# Altium schematic sheet BMS.SchDoc
size A; SheetNumber: 3; SheetTotal: 6
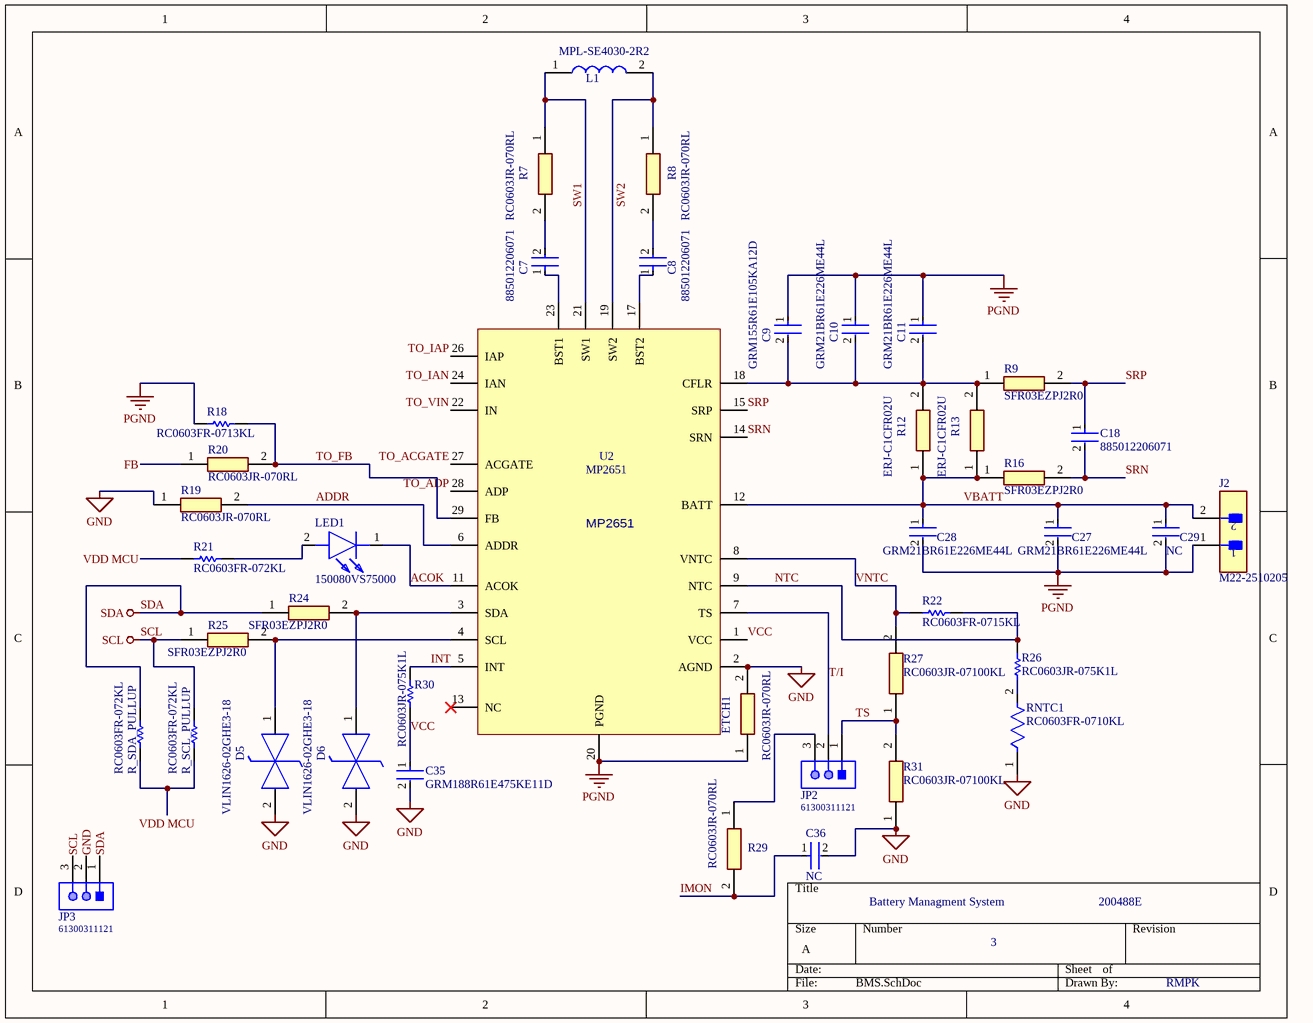
[diagram p0: BMS.SchDoc]

## Parts
C7  885012206071  [FP-885012206071-MFG]
C8  885012206071  [FP-885012206071-MFG]
C9  GRM155R61E105KA12D  [FP-GRM155-0_05-IPC_B]
C10  GRM21BR61E226ME44L  [FP-GRM21B-0_2-e0_2_0_7-IPC_B]
C11  GRM21BR61E226ME44L  [FP-GRM21B-0_2-e0_2_0_7-IPC_B]
C18  885012206071  [FP-885012206071-MFG]
C27  GRM21BR61E226ME44L  [FP-GRM21B-0_2-e0_2_0_7-IPC_B]
C28  GRM21BR61E226ME44L  [FP-GRM21B-0_2-e0_2_0_7-IPC_B]
C29  NC  [FP-GRM21B-0_2-e0_2_0_7-IPC_B]
C35  GRM188R61E475KE11D  [FP-GRM188-0_15-IPC_C]
C36  NC  [FP-GRM21B-0_2-e0_2_0_7-IPC_B]
D5  VLIN1626-02GHE3-18  [SOD2713X115N]
D6  VLIN1626-02GHE3-18  [SOD2713X115N]
ETCH1  RC0603JR-070RL  [RESC1608X55N]
J2  M22-2510205  [FP-M22-2510205-MFG]
JP2  61300311121  [61300311121]
JP3  61300311121  [61300311121]
L1  MPL-SE4030-2R2  [MPLSE40302R2]
LED1  150080VS75000  [LEDC2012X80N]
R7  RC0603JR-070RL  [RESC1608X55N]
R8  RC0603JR-070RL  [RESC1608X55N]
R9  SFR03EZPJ2R0  [RESC1608X55N]
R12  ERJ-C1CFR02U  [ERJC1]
R13  ERJ-C1CFR02U  [ERJC1]
R16  SFR03EZPJ2R0  [RESC1608X55N]
R18  RC0603FR-0713KL  [RESC1608X55X25LL10T15]
R19  RC0603JR-070RL  [RESC1608X55N]
R20  RC0603JR-070RL  [RESC1608X55N]
R21  RC0603FR-072KL  [RESC1608X55X25LL10T15]
R22  RC0603FR-0715KL  [RESC1608X55X25LL10T15]
R24  SFR03EZPJ2R0  [RESC1608X55N]
R25  SFR03EZPJ2R0  [RESC1608X55N]
R26  RC0603JR-075K1L  [RESC1608X55X25LL10T15]
R27  RC0603JR-07100KL  [RESC1608X55N]
R29  RC0603JR-070RL  [RESC1608X55N]
R30  RC0603JR-075K1L  [RESC1608X55X25LL10T15]
R31  RC0603JR-07100KL  [RESC1608X55N]
R_SCL_PULLUP  RC0603FR-072KL  [RESC1608X55X25LL10T15]
R_SDA_PULLUP  RC0603FR-072KL  [RESC1608X55X25LL10T15]
RNTC1  RC0603FR-0710KL  [FP-RC0603-0_55-IPC_C]
U2  MP2651  [MP2651]

## Nets
GND: C35.2 C36.2 D5.2(K2) D6.2(K2) ETCH1.2 JP3.2 R19.1 R31.1 RNTC1.1 U2.2(AGND)
PGND: C9.1 C10.1 C11.1 C27.2 C28.2 C29.2 ETCH1.1 J2.1 R18.1 U2.20(PGND)
SCL: JP3.3 R25.1 R_SCL_PULLUP.2
SDA: JP3.1 R24.1 R_SDA_PULLUP.2
ACOK: LED1.1(K) U2.11(ACOK)
ADDR: R19.2 U2.6(ADDR)
FB: R20.1
IMON: C36.1 R29.2
INT: R30.2 U2.5(INT)
NTC: R22.2 R26.2 U2.9(NTC)
SRN: C18.2 R16.2 U2.14(SRN)
SRP: C18.1 R9.2 U2.15(SRP)
SW1: L1.1 R7.1 U2.21(SW1)
SW2: L1.2 R8.1 U2.19(SW2)
T/I: JP2.2 U2.7(TS)
TO_ACGATE: U2.27(ACGATE)
TO_ADP: U2.28(ADP)
TO_FB: R18.2 R20.2 U2.29(FB)
TO_IAN: U2.24(IAN)
TO_IAP: U2.26(IAP)
TO_VIN: U2.22(IN)
TS: JP2.1 R27.1 R31.2
VBATT: C27.1 C28.1 C29.1 J2.2 R12.1 R13.1 R16.1 U2.12(BATT)
VCC: C35.1 R30.1 U2.1(VCC)
VDD MCU: R21.1 R_SCL_PULLUP.1 R_SDA_PULLUP.1
VNTC: R22.1 R27.2 U2.8(VNTC)
NetC7_1: C7.1 U2.23(BST1)
NetC7_2: C7.2 R7.2
NetC8_1: C8.1 U2.17(BST2)
NetC8_2: C8.2 R8.2
NetC9_2: C9.2 C10.2 C11.2 R9.1 R12.2 R13.2 U2.18(CFLR)
NetD5_1: D5.1(K1) R25.2 U2.4(SCL)
NetD6_1: D6.1(K1) R24.2 U2.3(SDA)
NetJP2_3: JP2.3 R29.1
NetLED1_2: LED1.2(A) R21.2
NetR26_1: R26.1 RNTC1.2

Not connected (* = marked no-connect by the designer): U2 13(NC)*

## Notes on the sheet
- Battery Managment System
- 200488E
- 3
- RMPK

## Library data of the parts
C7 C8 C18 = CMP-207839-000033-1: CAP CER 0.1UF 25V X7R 0603; Capacitance: 100nF; Tolerance: 10%; Case Code (Metric): 1608; Case/Package: 0603; Max Operating Temperature: 125°C; Dielectric: X7R; Voltage Rating: 25V; Min Operating Temperature: -55°C; Mount: Surface Mount; Voltage Rating (DC): 25V; Series: WCAP-CSGP; Packaging: Cut Tape; Case Code (Imperial): 0603; Thickness: 0.037inch; Width: 0.031inch; RoHS Compliant: Yes; Length: 0.063inch
C9 = CMP-2008-04581-2: Chip Multilayer Ceramic Capacitors for General Purpose, 0402, 1.0uF, X5R, 15%, 10%, 25V; Capacitance: 1uF; Height: 0.5mm; Voltage: 25V; Tolerance: 10%; Termination: SMD/SMT; Dielectric: X5R; REACH SVHC: No SVHC; Case Code (Imperial): 0402; Max Operating Temperature: 85°C; Lead Free: Lead Free; Case/Package: 0402; Mount: Surface Mount; Width: 0.5mm; Weight: 0.000212oz; Min Operating Temperature: -55°C; Voltage Rating (DC): 25V; Length: 1mm; Thickness: 0.022inch; Voltage Rating: 25V; Material: Ceramic; Case Code (Metric): 1005; Package Quantity: 10000; Packaging: Tape and Reel; Depth: 0.5mm
C10 C11 C27-C29 C36 = CMP-2007-03222-3: Chip Multilayer Ceramic Capacitors for General Purpose, 0805, 22uF, X5R, 15%, 20%, 25V; Case/Package: 0805; Depth: 1.25mm; Resistor Type: Ceramic; Voltage Rating: 25V; Lead Free: Lead Free; Voltage Rating (DC): 25V; Case Code (Metric): 2012; Thickness: 0.057inch; REACH SVHC: No SVHC; Material: Ceramic; Tolerance: 20%; Length: 2mm; Capacitance: 22uF; Case Code (Imperial): 0805; Max Operating Temperature: 85°C; Termination: SMD/SMT; Weight: 0.000335oz; Dielectric: X5R; Packaging: Tape and Reel; Voltage: 25V; Package Quantity: 3000; Height: 1.25mm; Mount: Surface Mount; Width: 1.25mm; Min Operating Temperature: -55°C
C35 = CMP-2006-02523-2: Chip Multilayer Ceramic Capacitors for General Purpose, 0603, 4.7uF, X5R, 15%, 10%, 25V; Case Code (Metric): 1608; Max Operating Temperature: 85°C; REACH SVHC: No SVHC; Voltage Rating: 25V; Dielectric: X5R; Packaging: Cut Tape; Width: 0.031inch; Min Operating Temperature: -55°C; Lead Free: Lead Free; Capacitance: 4.7uF; Height: 0.8mm; Case Code (Imperial): 0603; Length: 1.6mm; Voltage Rating (DC): 25V; Case/Package: 0603; Voltage: 25V; Tolerance: 10%; Thickness: 0.031inch; Mount: Surface Mount; Material: Ceramic; Package Quantity: 4000; Depth: 0.8mm
D5 D6 = VLIN1626-02GHE3-18: Diode ESD (Bi-directional); Manufacturer_Name: Vishay; Datasheet Link: https://www.mouser.com/datasheet/2/427/vlin1626_02g-1767732.pdf; Height: 1.15mm; Manufacturer_Part_Number: VLIN1626-02GHE3-18; Mouser Part Number: 78-VLIN1626-02GHE318; Mouser Price/Stock: https://www.mouser.co.uk/ProductDetail/Vishay-Semiconductors/VLIN1626-02GHE3-18?qs=nIjV%252BW72yUtWws5A0kqvDg%3D%3D
ETCH1 R7 R8 R19 R20 R29 = RC0603JR-070RL: Resistor; Manufacturer_Name: YAGEO; Datasheet Link: https://componentsearchengine.com/Datasheets/2/RC0603JR-070RL.pdf; Height: 0.55mm; Manufacturer_Part_Number: RC0603JR-070RL; Mouser Part Number: 603-RC0603JR-070RL; Mouser Price/Stock: https://www.mouser.co.uk/ProductDetail/YAGEO/RC0603JR-070RL?qs=2cAdsCoAWRGWyPcuXgGiXQ%3D%3D; Arrow Part Number: RC0603JR-070RL; Arrow Price/Stock: https://www.arrow.com/en/products/rc0603jr-070rl/yageo?region=europe
J2 = CMP-15831-000005-1: CONN HEADER VERT 2POS 2MM; Manufacturer: Harwin; Conn Gender: Male; Current Rating: 2A; Number Of Contacts: 2; Conn Orientation: Vertical; Temperature Range Low: -40°C; Device Class L1: Connectors; ComponentLink2URL: https://cdn.harwin.com/pdfs/C018XX_M22_Series_Connectors.pdf; Temperature Range High: +105°C; Pitch: 2mm; Number Of Rows: 1; Temperature: -40°C to +105°C; Automotive: No; Device Class L3: unset; Octopart: https://octopart.com/m22-2510205-harwin-2538221; Mouser Description: Headers & Wire Housings 2 PIN SIL VERTICAL GOLD PIN HEADER; Height: 5.45mm; Category: Conn; Digikey Description: CONN HEADER VERT 2POS 2MM; Contact Material: Gold,Nickel; Lead Free: Yes; ComponentLink2Description: Datasheet; Manufacturer Part Number: M22-2510205; Device Class L2: Headers and Wire Housings; Package: 0; Footprint Url: https://cdn.harwin.com/pdfs/M22-251.pdf; RoHS: TRUE
JP2 JP3 = CMP-1502-01062-1: THT Vertical Pin Header WR-PHD, Pitch 2.54 mm, Single Row, 3 pins; Manufacturer: Wurth Elektronik; Withstanding Voltage: 500VAC; Working Voltage: 250VAC; Rated Current: 3A; Pitch: 2.54mm; Pin Number: 3; Gender: Male; Contact Resistance: 20mOhm; Package Reference: 61300311121; Manufacturer URL: http://www.we-online.de; Datasheet URL: https://katalog.we-online.de/em/datasheet/6130xx11121.pdf; Operating Temperature: -40to105degC; Part Number: 61300311121; Orientation: Vertical; Packaging: Bag; Row Number: Single; Mounting Technology: THT; Publisher: WurthElektronik
L1 = MPL-SE4030-2R2: Inductor; Manufacturer_Name: Monolithic Power Systems (MPS); Datasheet Link: https://www.monolithicpower.com/en/documentview/productdocument/index/version/2/document_type/Datasheet/lang/en/sku/MPL-SE4030-2R2/document_id/5900/; Height: 3mm; Manufacturer_Part_Number: MPL-SE4030-2R2; Mouser Part Number: 946-MPL-SE4030-2R2; Mouser Price/Stock: https://www.mouser.co.uk/ProductDetail/Monolithic-Power-Systems-MPS/MPL-SE4030-2R2?qs=sPbYRqrBIVkUqvyiguqldQ%3D%3D
LED1 = 150080VS75000: LED; Manufacturer_Name: Wurth Elektronik; Datasheet Link: http://katalog.we-online.com/led/datasheet/150080VS75000.pdf; Height: 0.8mm; Manufacturer_Part_Number: 150080VS75000; Mouser Part Number: 710-150080VS75000; Mouser Price/Stock: https://www.mouser.co.uk/ProductDetail/Wurth-Elektronik/150080VS75000?qs=LlUlMxKIyB0tGHJmO6%252B0ug%3D%3D
R9 R16 R24 R25 = SFR03EZPJ2R0: Resistor; Manufacturer_Name: ROHM Semiconductor; Datasheet Link: https://www.mouser.com/datasheet/2/348/ROHM_S_A0009648217_1-2563033.pdf; Height: 0.55mm; Manufacturer_Part_Number: SFR03EZPJ2R0
R12 R13 = ERJ-C1CFR02U: Resistor; Manufacturer_Name: Panasonic; Datasheet Link: https://industrial.panasonic.com/cdbs/www-data/pdf/RDP0000/AOA0000C340.pdf; Height: 0.75mm; Manufacturer_Part_Number: ERJ-C1CFR02U; Mouser Part Number: 667-ERJ-C1CFR02U; Mouser Price/Stock: https://www.mouser.co.uk/ProductDetail/Panasonic/ERJ-C1CFR02U?qs=Z3CaLxJiOJL4jODaXLT4ow%3D%3D
R18 = CMP-2000-06927-1: Chip Resistor, 13 KOhm, +/- 1%, 0.1 W, -55 to 155 degC, 0603 (1608 Metric), RoHS, Tape and Reel; Manufacturer: Yageo; Resistance: 13kOhms; Temperature Coefficient: 100PPM/C; Voltage Rating: 50V; Power Rating: 100mW; Packaging: Reel; Case Code - mm: 1608; Manufacturer URL: http://www.yageo.com/; Tolerance: 1%; Product: ThickFilmResistorsGeneralPurpose; Datasheet URL: http://www.yageo.com/documents/recent/PYu-RC_Group_51_RoHS_L_7.pdf; Package Reference: 0603; Operating Temperature Range: -55Cto+155C; Package Description: 2-Pin Surface Mount Device, Body 1.6 x 0.8 mm; Termination Style: SMD/SMT; Series: RC; Case Code - in: 0603; Datasheet Version: Rev. 7, 05/2017; Mounting Technology: SurfaceMount
R21 R_SCL_PULLUP R_SDA_PULLUP = CMP-2000-06937-1: Chip Resistor, 2 KOhm, +/- 1%, 50 V, -55 to 155 degC, 0603 (1608 Metric), RoHS, Tape and Reel; Manufacturer: Yageo; PCN Other: RC/AC0603/0805/120622/Jan/2013; Resistance (Ohms): 2k; Catalog Drawings: ThickFilmResistorTopThickFilmResistorSide; Kits: PHH4-KIT-ND-RESKIT1K-9.76K1/10W5700PCS; EDA / CAD Models: DownloadfromAcceleratedDesigns; HTML Datasheet: RCSeries,LSuffixDatasheet.html; Power (Watts): 0.1W,1/10W; Other Names: 311-2.00KHRCT; Temperature Coefficient: ±100ppm/°C; Online Catalog: RC0603Series; Features: MoistureResistant; Height: 0.022"(0.55mm); Size / Dimension: 0.063"Lx0.031"W(1.60mmx0.80mm); Product Training Modules: ChipResistor; Mounting Technology: SurfaceMount; Package / Case: 0603(1608Metric); Supplier Device Package: 0603; Category: Resistors; Tolerance: ±1%; Packaging: CutTape(CT); Operating Temperature: -55°C~155°C; Standard Package: 1; Series: RC; Datasheet URL: http://www.yageo.com/documents/recent/PYu-RC_Group_51_RoHS_L_7.pdf; Package Description: 2-Pin Surface Mount Device, Body 1.6 x 0.8 mm; Number of Terminations: 2; Datasheet Version: Rev. 7, 05/2017; Package Reference: 0603; Composition: ThickFilm; Manufacturer URL: http://www.yageo.com/; Family: ChipResistor-SurfaceMount
R22 = CMP-1659-00032-1: Chip Resistor, 15 KOhm, +/- 1%, 0.1 W, -55 to 155 degC, 0603 (1608 Metric), RoHS, Tape and Reel; PackageDescription: 2-Pin Surface Mount Device, Body 1.6 x 0.8 mm; RoHSCompliant: true; ComponentLink2Description: Datasheet; DatasheetVersion: Rev. 4, 02/2016; ComponentLink1Description: Manufacturer URL; ComponentLink1URL: http://www.yageo.com/; PackageReference: 0603; ComponentLink2URL: http://www.yageo.com/documents/recent/PYu-RC_Group_51_RoHS_L_04.pdf
R26 R30 = CMP-1012-00091-2: Chip Resistor, 5.1 KOhm, +/- 5%, 0.1 W, -55 to 155 degC, 0603 (1608 Metric), RoHS, Tape and Reel; Manufacturer: Yageo; Resistance: 5.1kOhms; Voltage Rating: 50V; Temperature Coefficient: 100PPM/C; Power Rating: 100mW; Mounting Technology: SurfaceMount; Case Code - in: 0603; Product: ThickFilmResistorsGeneralPurpose; Series: RC; Packaging: Reel; Tolerance: 5%; Operating Temperature Range: -55Cto+155C; Package Description: 2-Pin Surface Mount Device, Body 1.6 x 0.8 mm; Manufacturer URL: http://www.yageo.com/; Datasheet Version: Rev. 7, 05/2017; Termination Style: SMD/SMT; Package Reference: 0603; Datasheet URL: http://www.yageo.com/documents/recent/PYu-RC_Group_51_RoHS_L_7.pdf; Case Code - mm: 1608
R27 R31 = RC0603JR-07100KL: Resistor; Manufacturer_Name: YAGEO; Datasheet Link: https://www.yageo.com/upload/media/product/productsearch/datasheet/rchip/PYu-RC_Group_51_RoHS_L_12.pdf; Height: 0.55mm; Manufacturer_Part_Number: RC0603JR-07100KL; Mouser Part Number: 603-RC0603JR-07100KL; Mouser Price/Stock: https://www.mouser.co.uk/ProductDetail/YAGEO/RC0603JR-07100KL?qs=2cAdsCoAWRG9Rhqklpdeqg%3D%3D; Arrow Part Number: RC0603JR-07100KL; Arrow Price/Stock: https://www.arrow.com/en/products/rc0603jr-07100kl/yageo?region=europe
RNTC1 = CMP-2100-03664-2: RES 10K OHM 1% 1/10W 0603; Voltage Rating: 75V; Voltage Rating (DC): 50V; Resistance: 10kR; Power Rating: 100mW; Temperature Coefficient: 100ppm/°C; Depth: 0.8mm; Termination: SMD/SMT; Resistor Type: Thick Film; Series: RC; Construction: Rectangular; Features: Moisture Resistant; Packaging: Tape and Reel; Min Operating Temperature: -55°C; Number of Terminations: 2; Lead Pitch: 0.3mm; RoHS Compliant: Yes; Case/Package: 0603; Resistance Tolerance: 1%; Military Standard: Not; Weight: 7.1E-05oz; Number of Pins: 2; Tolerance: 1%; Length: 1.6mm; Case Code (Imperial): 0603; Lead Free: Lead Free; Width: 0.8mm; Max Power Dissipation: 100mW; Height: 0.45mm; Max Operating Temperature: 155°C; Case Code (Metric): 1608; Size Code: 0603
U2 = MP2651: MP2651 – BUCK-BOOST CHARGER FOR 1 TO 4 CELLS IN SERIES